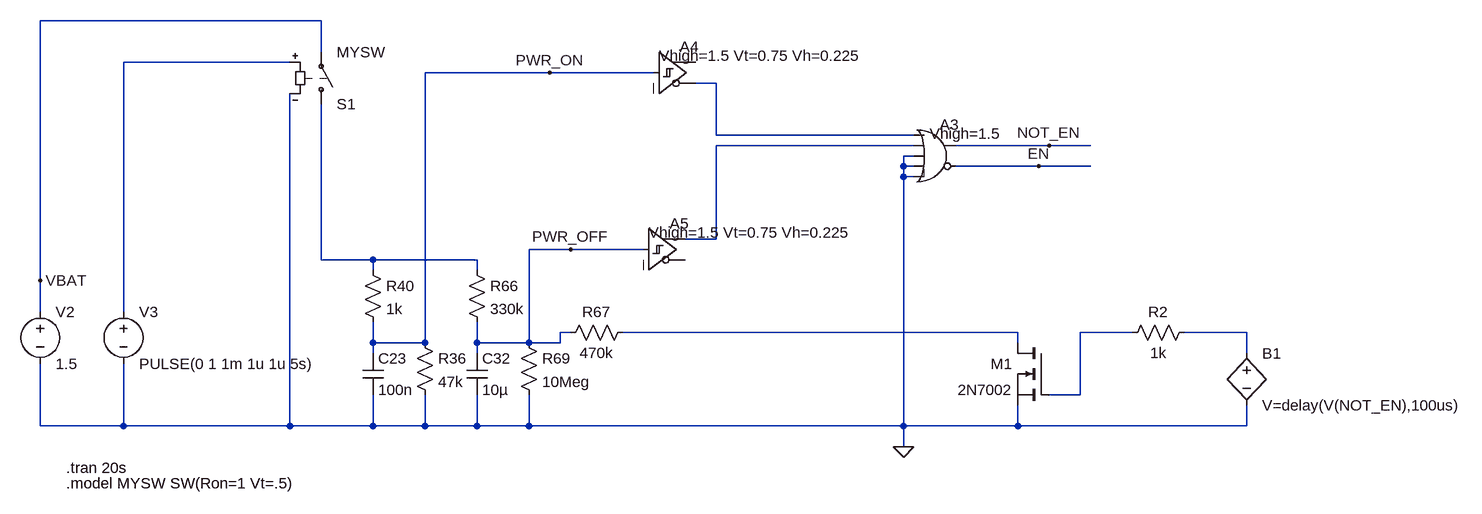
[diagram p0: schematic powercontrol.asc]
powercontrol.asc, the LTspice schematic file:
Version 4
SHEET 1 1852 680
WIRE 96 -64 -336 -64
WIRE 96 -16 96 -64
WIRE 48 0 -208 0
WIRE 448 16 256 16
WIRE 608 16 448 16
WIRE 704 32 672 32
WIRE 704 112 704 32
WIRE 1008 112 704 112
WIRE 1008 128 704 128
WIRE 1216 128 1072 128
WIRE 1280 128 1216 128
WIRE 1008 144 992 144
WIRE 992 160 992 144
WIRE 1008 160 992 160
WIRE 1200 160 1072 160
WIRE 1280 160 1200 160
WIRE 992 176 992 160
WIRE 1008 176 992 176
WIRE 704 272 704 128
WIRE 704 272 656 272
WIRE 480 288 416 288
WIRE 592 288 480 288
WIRE 96 304 96 64
WIRE 176 304 96 304
WIRE 336 304 176 304
WIRE 176 320 176 304
WIRE 336 320 336 304
WIRE -336 336 -336 -64
WIRE -336 384 -336 336
WIRE -208 384 -208 0
WIRE 480 416 464 416
WIRE 1168 416 560 416
WIRE 1344 416 1264 416
WIRE 1520 416 1424 416
WIRE 176 432 176 400
WIRE 256 432 256 16
WIRE 256 432 176 432
WIRE 336 432 336 400
WIRE 416 432 416 288
WIRE 416 432 336 432
WIRE 464 432 464 416
WIRE 464 432 416 432
WIRE 1168 432 1168 416
WIRE 176 448 176 432
WIRE 336 448 336 432
WIRE 1520 448 1520 416
WIRE 1264 512 1264 416
WIRE 1264 512 1216 512
WIRE -336 560 -336 464
WIRE -208 560 -208 464
WIRE -208 560 -336 560
WIRE 48 560 48 48
WIRE 48 560 -208 560
WIRE 176 560 176 512
WIRE 176 560 48 560
WIRE 256 560 256 512
WIRE 256 560 176 560
WIRE 336 560 336 512
WIRE 336 560 256 560
WIRE 416 560 416 512
WIRE 416 560 336 560
WIRE 992 560 992 176
WIRE 992 560 416 560
WIRE 1168 560 1168 528
WIRE 1168 560 992 560
WIRE 1520 560 1520 528
WIRE 1520 560 1168 560
WIRE 992 592 992 560
FLAG 992 592 0
FLAG 1216 128 NOT_EN
FLAG -336 336 VBAT
FLAG 448 16 PWR_ON
FLAG 480 288 PWR_OFF
FLAG 1200 160 EN
SYMBOL Digital/or 1040 80 R0
WINDOW 3 -8 30 Left 2
SYMATTR Value Vhigh=1.5
SYMATTR InstName A3
SYMBOL Digital/schmitt 608 -48 R0
WINDOW 3 8 38 Left 2
SYMATTR Value Vhigh=1.5 Vt=0.75 Vh=0.225
SYMATTR InstName A4
SYMBOL Digital/schmitt 592 224 R0
WINDOW 3 8 38 Left 2
SYMATTR Value Vhigh=1.5 Vt=0.75 Vh=0.225
SYMATTR InstName A5
SYMBOL bv 1520 432 R0
SYMATTR InstName B1
SYMATTR Value V=delay(V(NOT_EN),100us)
SYMBOL nmos 1216 432 M0
SYMATTR InstName M1
SYMATTR Value 2N7002
SYMBOL voltage -336 368 R0
SYMATTR InstName V2
SYMATTR Value 1.5
SYMBOL Res 1440 400 R90
WINDOW 0 0 56 VBottom 2
WINDOW 3 32 56 VTop 2
SYMATTR InstName R2
SYMATTR Value 1k
SYMBOL sw 96 80 M180
SYMATTR InstName S1
SYMATTR Value MYSW
SYMBOL voltage -208 368 R0
SYMATTR InstName V3
SYMATTR Value PULSE(0 1 1m 1u 1u 5s)
SYMBOL Res 160 304 R0
SYMATTR InstName R40
SYMATTR Value 1k
SYMBOL Res 320 304 R0
SYMATTR InstName R66
SYMATTR Value 330k
SYMBOL Res 400 416 R0
SYMATTR InstName R69
SYMATTR Value 10Meg
SYMBOL Res 240 416 R0
SYMATTR InstName R36
SYMATTR Value 47k
SYMBOL Cap 160 448 R0
SYMATTR InstName C23
SYMATTR Value 100n
SYMBOL Cap 320 448 R0
SYMATTR InstName C32
SYMATTR Value 10µ
SYMBOL Res 576 400 R90
WINDOW 0 0 56 VBottom 2
WINDOW 3 32 56 VTop 2
SYMATTR InstName R67
SYMATTR Value 470k
TEXT -296 624 Left 2 !.tran 20s
TEXT -296 648 Left 2 !.model MYSW SW(Ron=1 Vt=.5)

The netlist it stands for:
* powercontrol.asc
A3 N002 N003 0 0 0 EN NOT_EN 0 OR Vhigh=1.5
A4 PWR_ON 0 0 0 0 N002 0 0 SCHMITT Vhigh=1.5 Vt=0.75 Vh=0.225
A5 PWR_OFF 0 0 0 0 0 N003 0 SCHMITT Vhigh=1.5 Vt=0.75 Vh=0.225
B1 N007 0 V=delay(V(NOT_EN),100us)
M1 N005 N006 0 0 2N7002
V2 VBAT 0 1.5
R2 N007 N006 1k
S1 N004 VBAT N001 0 MYSW
V3 N001 0 PULSE(0 1 1m 1u 1u 5s)
R40 N004 PWR_ON 1k
R66 N004 PWR_OFF 330k
R69 PWR_OFF 0 10Meg
R36 PWR_ON 0 47k
C23 PWR_ON 0 100n
C32 PWR_OFF 0 10µ
R67 N005 PWR_OFF 470k
.model NMOS NMOS
.model PMOS PMOS
.lib standard.mos
.tran 20s
.model MYSW SW(Ron=1 Vt=.5)
.backanno
.end